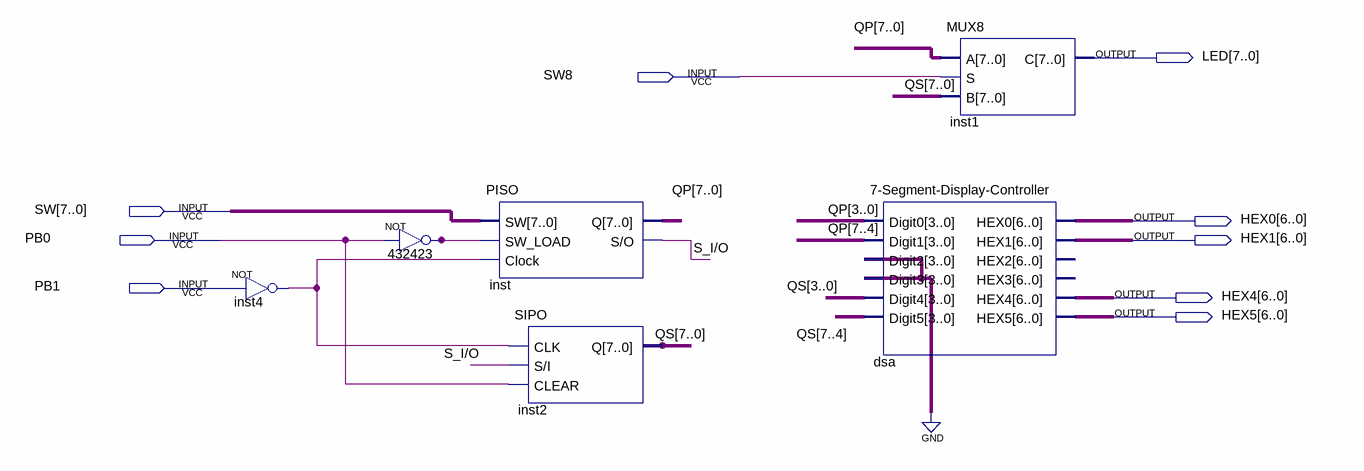
[diagram p0: schematic sheet]
// Quartus schematic LAB03.bdf as structural Verilog: 6 symbols, 9 pins
module LAB03 (
  input  SW8,
  input  [7:0] SW,
  input  PB0,
  input  PB1,
  output [7:0] LED,
  output [6:0] HEX0,
  output [6:0] HEX1,
  output [6:0] HEX4,
  output [6:0] HEX5
);

  wire inst4_out, n432423_out, \S_I/O ;
  wire [7:0] QP, QS;

  not inst4 (inst4_out, PB1);
  not u_432423 (n432423_out, PB0);
  PISO inst (.SW(SW), .SW_LOAD(n432423_out), .Clock(inst4_out), .Q(QP), .\S/O (\S_I/O ));
  SIPO inst2 (.CLK(inst4_out), .\S/I (\S_I/O ), .CLEAR(PB0), .Q(QS));
  \7-Segment-Display-Controller  dsa (
    .Digit0(QP[3:0]), .Digit1(QP[7:4]), .Digit2(4'b0000), .Digit3(4'b0000), .Digit4(QS[3:0]),
    .Digit5(QS[7:4]), .HEX0(HEX0), .HEX1(HEX1), .HEX4(HEX4), .HEX5(HEX5));  // open: HEX2, HEX3
  MUX8 inst1 (.A(QP), .S(SW8), .B(QS), .C(LED));
endmodule
